# EasyEDA schematic design.json
TITLE: S-ADAPT; REV: 1.0; Date: 2026-02-16; Sheet: 1/1; Drawn By: S-ADAPT; Company: KU
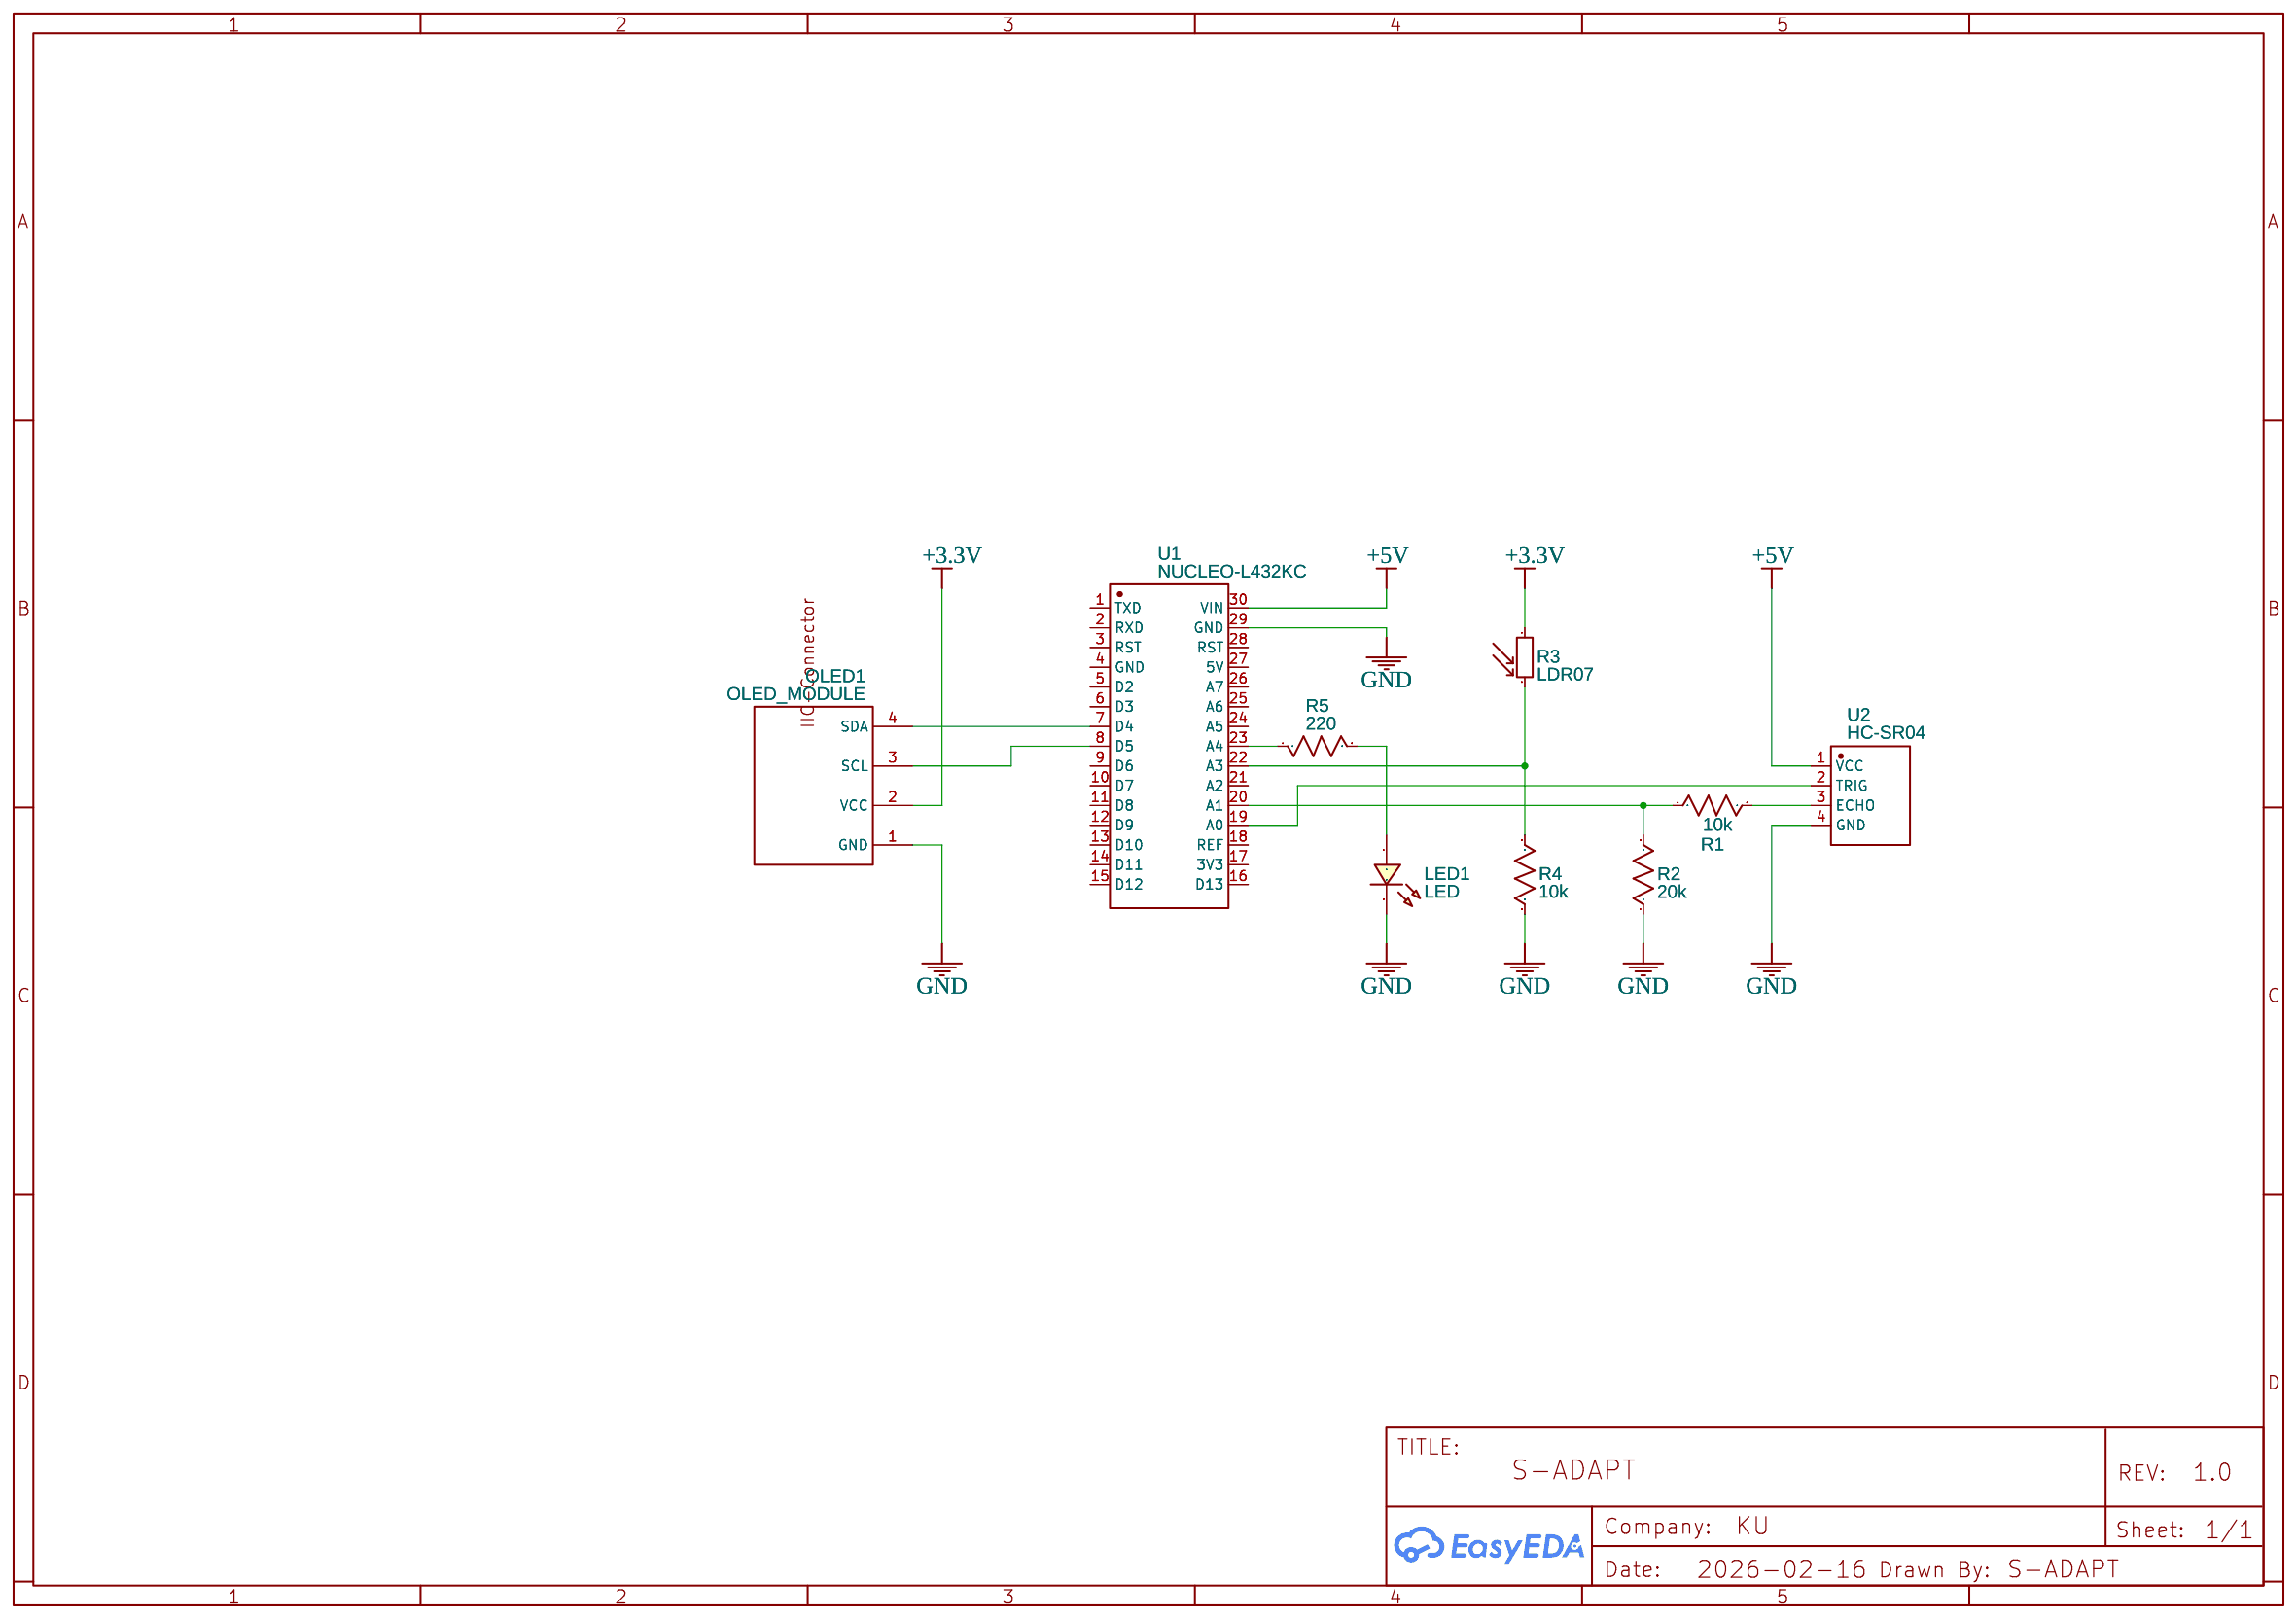
[diagram p0: schematic sheet]

## Parts
LED1  LED  [LED0603_RED]
OLED1  OLED_MODULE  [0.96OLED_4P]
R1  10k  [R0603]
R2  20k  [R0603]
R3  LDR07  [RESISTOR_LDR_5.1X4.3_RM3.4]
R4  10k  [R0603]
R5  220  [R0603]
U1  NUCLEO-L432KC  [DIP-30_L51.0-W17.8-P2.54-LS15.2-TL]
U2  HC-SR04  [TH_HC-SR04V]

## Library data of the parts
LED1 = LED-0603_R: Manufacturer: EVERLIGHT(台湾亿光); Manufacturer Part: 19-217/R6C-AL1M2VY/3T; Supplier Part: C72044; Supplier: LCSC; Contributor: LCEDA_01
OLED1 = 0.96OLED_4P_MODULE_JX: Contributor: LCSC; Supplier: LCSC; Supplier Part: C9900004566; Manufacturer: null; JLCPCB Part Class: Extended Part
R1 R2 R4 R5 = R_0603_US: Contributor: LCEDA_Lib
R3 = LDR07: Contributor: KiCAD; license: https://www.gnu.org/licenses/lgpl-2.1.html
U1 = NUCLEO-L432KC: Supplier: LCSC; Manufacturer: ST(意法半导体); Supplier Part: C94814
U2 = HC-SR04: Supplier: LCSC; Supplier Part: C19857336; Manufacturer: Universal Microelectronics; Contributor: lcsc; JLCPCB Part Class: Extended Part

## Nets
+3.3V: OLED1.2(VCC) R3.1
+5V: U1.30(VIN) U2.1(VCC)
GND: LED1.2 OLED1.1(GND) R2.1 R4.2 U1.29(GND) U2.4(GND)
Net-(LED1-1): LED1.1 R5.2
Net-(OLED1-3): OLED1.3(SCL) U1.8(D5)
Net-(OLED1-4): OLED1.4(SDA) U1.7(D4)
Net-(R1-1): R1.1 U2.3(ECHO)
Net-(R1-2): R1.2 R2.2 U1.20(A1)
Net-(R3-2): R3.2 R4.1 U1.22(A3)
Net-(R5-1): R5.1 U1.23(A4)
Net-(U1-19): U1.19(A0) U2.2(TRIG)

Not connected (* = marked no-connect by the designer): U1 1(TXD) 2(RXD) 3(RST) 4(GND) 5(D2) 6(D3) 9(D6) 10(D7) 11(D8) 12(D9) 13(D10) 14(D11) 15(D12) 16(D13) 17(3V3) 18(REF) 21(A2) 24(A5) 25(A6) 26(A7) 27(5V) 28(RST)
